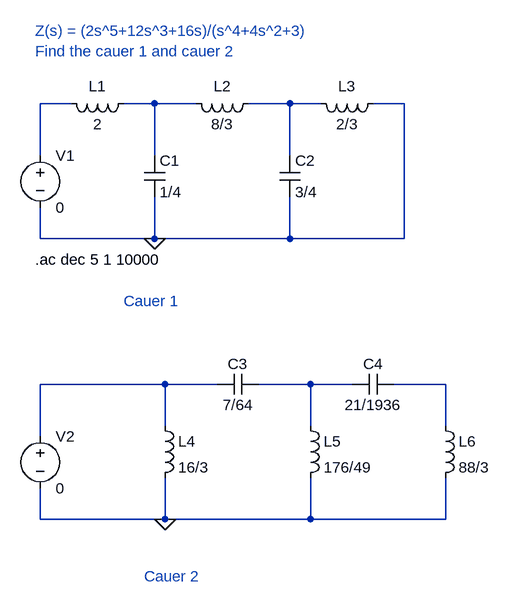
[diagram p0: schematic Lab8_ques2.asc]
Lab8_ques2.asc, the LTspice schematic file:
Version 4
SHEET 1 1552 936
WIRE 96 192 48 192
WIRE 224 192 176 192
WIRE 288 192 224 192
WIRE 432 192 368 192
WIRE 480 192 432 192
WIRE 608 192 560 192
WIRE 48 272 48 192
WIRE 224 272 224 192
WIRE 432 272 432 192
WIRE 48 400 48 352
WIRE 224 400 224 336
WIRE 224 400 48 400
WIRE 432 400 432 336
WIRE 432 400 224 400
WIRE 608 400 608 192
WIRE 608 400 432 400
WIRE 240 624 48 624
WIRE 320 624 240 624
WIRE 464 624 384 624
WIRE 528 624 464 624
WIRE 672 624 592 624
WIRE 240 688 240 624
WIRE 464 688 464 624
WIRE 672 688 672 624
WIRE 48 704 48 624
WIRE 48 832 48 784
WIRE 240 832 240 768
WIRE 240 832 48 832
WIRE 464 832 464 768
WIRE 464 832 240 832
WIRE 672 832 672 768
WIRE 672 832 464 832
FLAG 224 400 0
FLAG 240 832 0
SYMBOL Cap 208 272 R0
SYMATTR InstName C1
SYMATTR Value 1/4
SYMBOL Cap 416 272 R0
SYMATTR InstName C2
SYMATTR Value 3/4
SYMBOL Ind 192 176 R90
WINDOW 0 5 56 VBottom 2
WINDOW 3 32 56 VTop 2
SYMATTR InstName L1
SYMATTR Value 2
SYMBOL Ind 384 176 R90
WINDOW 0 5 56 VBottom 2
WINDOW 3 32 56 VTop 2
SYMATTR InstName L2
SYMATTR Value 8/3
SYMBOL Ind 576 176 R90
WINDOW 0 5 56 VBottom 2
WINDOW 3 32 56 VTop 2
SYMATTR InstName L3
SYMATTR Value 2/3
SYMBOL Voltage 48 256 R0
SYMATTR InstName V1
SYMATTR Value 0
SYMATTR Value2 AC 1
SYMBOL Cap 384 608 R90
WINDOW 0 0 32 VBottom 2
WINDOW 3 32 32 VTop 2
SYMATTR InstName C3
SYMATTR Value 7/64
SYMBOL Cap 592 608 R90
WINDOW 0 0 32 VBottom 2
WINDOW 3 32 32 VTop 2
SYMATTR InstName C4
SYMATTR Value 21/1936
SYMBOL Ind 224 672 R0
SYMATTR InstName L4
SYMATTR Value 16/3
SYMBOL Ind 448 672 R0
SYMATTR InstName L5
SYMATTR Value 176/49
SYMBOL Ind 656 672 R0
SYMATTR InstName L6
SYMATTR Value 88/3
SYMBOL Voltage 48 688 R0
SYMATTR InstName V2
SYMATTR Value 0
SYMATTR Value2 AC 1
TEXT 40 432 Left 2 !.ac dec 5 1 10000
TEXT 40 80 Left 2 ;Z(s) = (2s^5+12s^3+16s)/(s^4+4s^2+3)\nFind the cauer 1 and cauer 2
TEXT 176 496 Left 2 ;Cauer 1
TEXT 208 920 Left 2 ;Cauer 2

The netlist it stands for:
* Lab8_ques2.asc
C1 N002 0 1/4
C2 N003 0 3/4
L1 N002 N001 2
L2 N003 N002 8/3
L3 0 N003 2/3
V1 N001 0 0 AC 1
C3 N005 N004 7/64
C4 N006 N005 21/1936
L4 N004 0 16/3
L5 N005 0 176/49
L6 N006 0 88/3
V2 N004 0 0 AC 1
.ac dec 5 1 10000
* Z(s) = (2s^5+12s^3+16s)/(s^4+4s^2+3)
* Find the cauer 1 and cauer 2
* Cauer 1
* Cauer 2
.backanno
.end